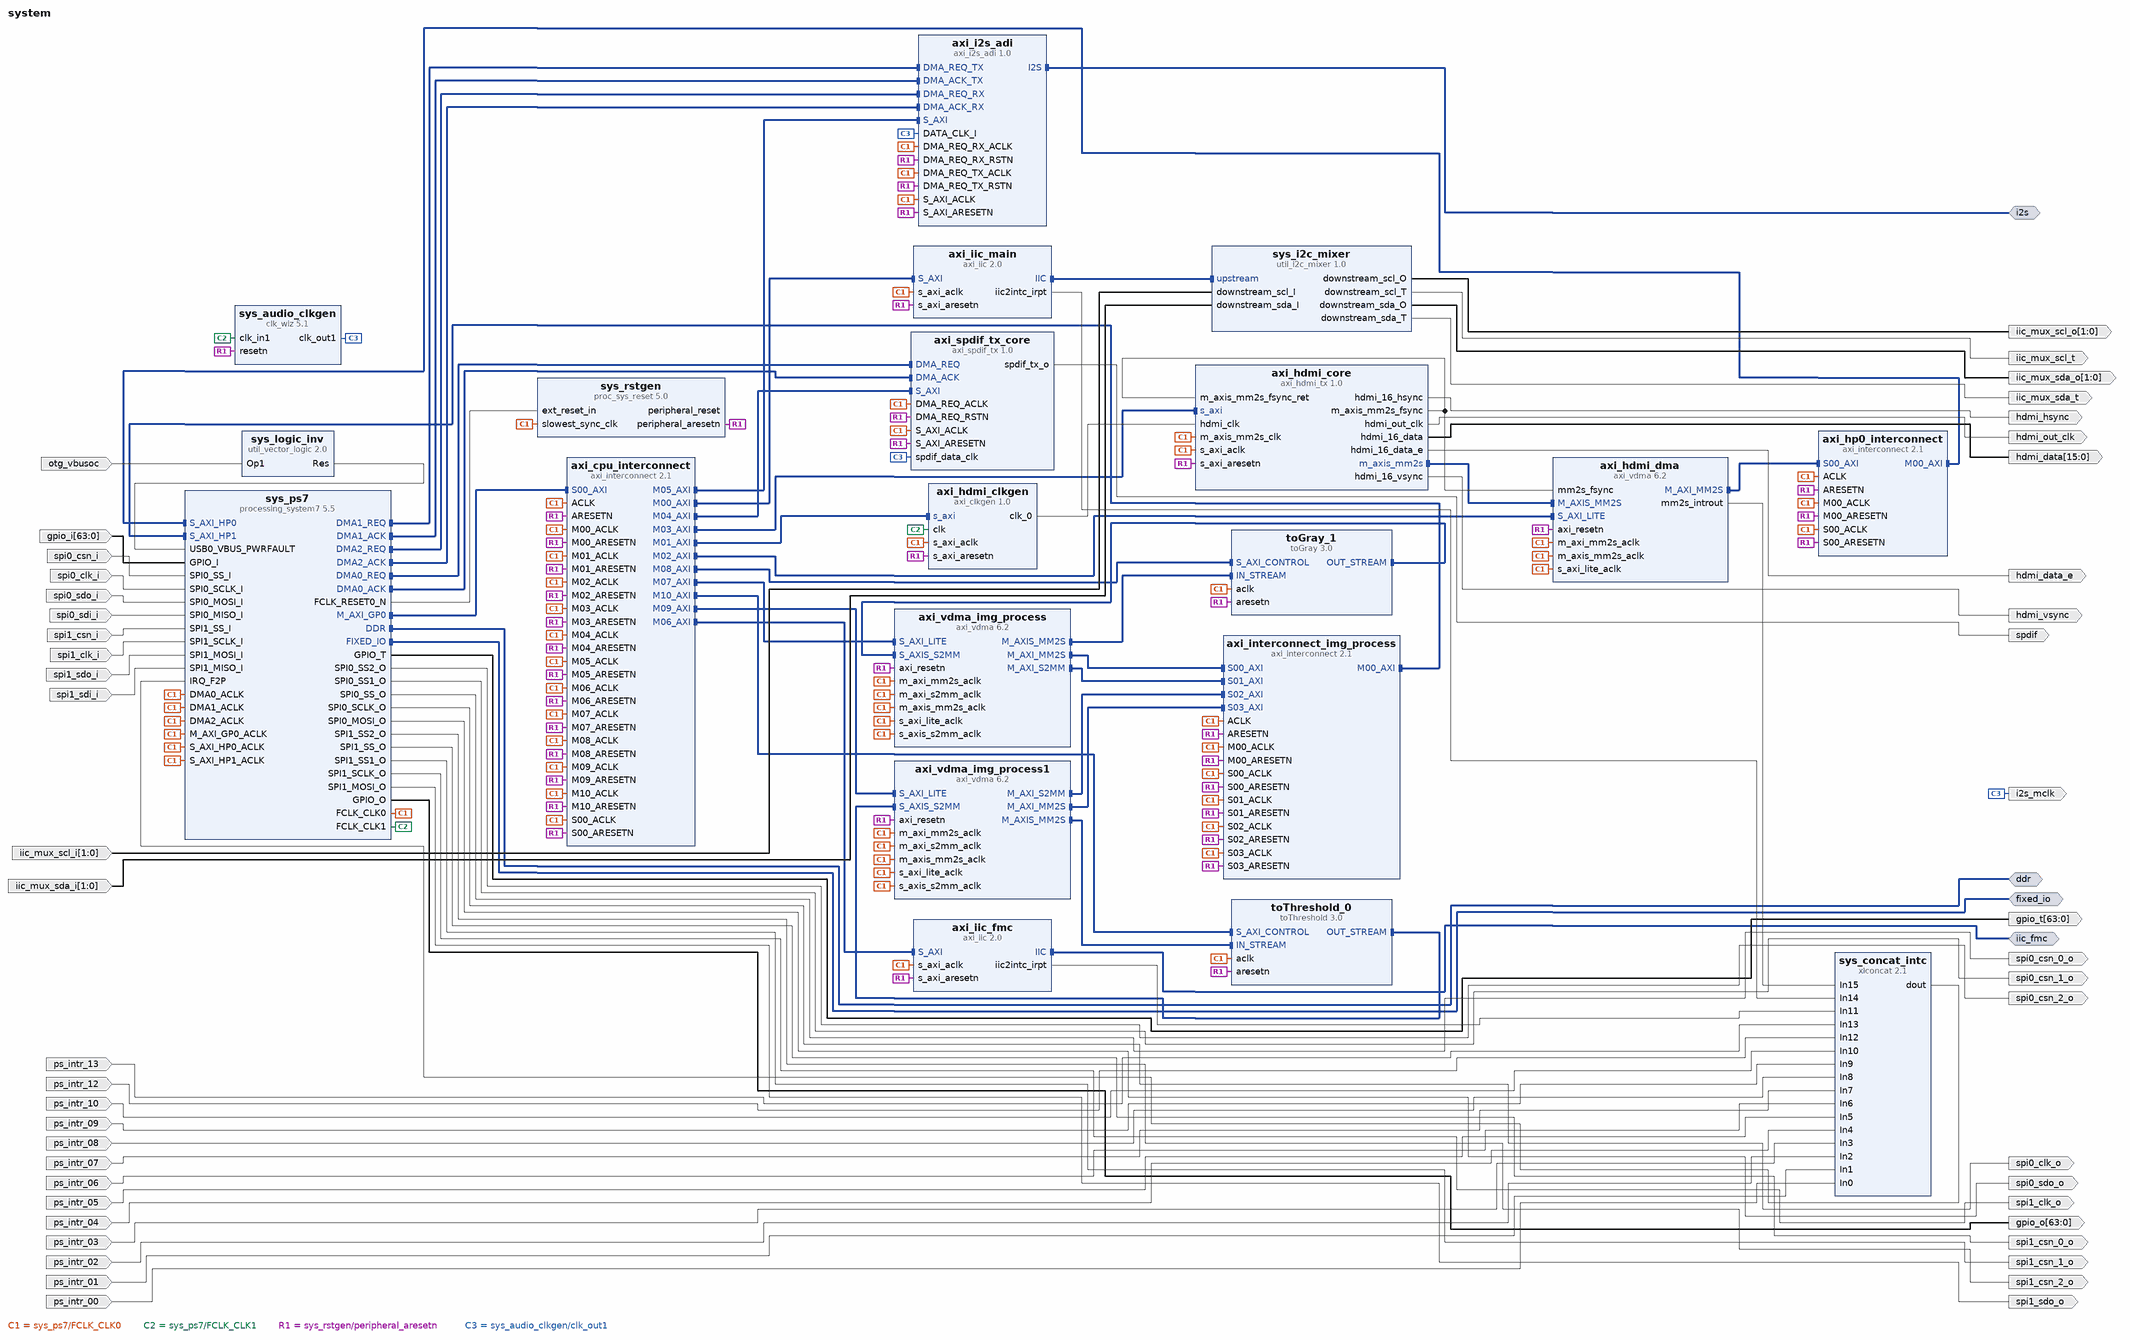
[diagram p0: block diagram of the top level]
# Vivado block design system, Vivado 2014.4
create_bd_design system

create_bd_intf_port -mode Master -vlnv xilinx.com:interface:ddrx_rtl:1.0 ddr
create_bd_intf_port -mode Master -vlnv xilinx.com:display_processing_system7:fixedio_rtl:1.0 fixed_io
create_bd_intf_port -mode Master -vlnv xilinx.com:interface:iic_rtl:1.0 iic_fmc
create_bd_intf_port -mode Master -vlnv analog.com:interface:i2s_rtl:1.0 i2s
create_bd_port -dir I -from 63 -to 0 gpio_i
create_bd_port -dir O -from 63 -to 0 gpio_t
create_bd_port -dir I -from 1 -to 0 iic_mux_scl_i
create_bd_port -dir O -from 1 -to 0 iic_mux_scl_o
create_bd_port -dir O iic_mux_scl_t
create_bd_port -dir I -from 1 -to 0 iic_mux_sda_i
create_bd_port -dir O -from 1 -to 0 iic_mux_sda_o
create_bd_port -dir O iic_mux_sda_t
create_bd_port -dir I otg_vbusoc
create_bd_port -dir O spi0_csn_2_o
create_bd_port -dir O spi0_csn_1_o
create_bd_port -dir O spi0_csn_0_o
create_bd_port -dir I spi0_csn_i
create_bd_port -dir I spi0_clk_i
create_bd_port -dir O spi0_clk_o
create_bd_port -dir I spi0_sdo_i
create_bd_port -dir O spi0_sdo_o
create_bd_port -dir I spi0_sdi_i
create_bd_port -dir O spi1_csn_2_o
create_bd_port -dir O spi1_csn_1_o
create_bd_port -dir O spi1_csn_0_o
create_bd_port -dir I spi1_csn_i
create_bd_port -dir I spi1_clk_i
create_bd_port -dir O spi1_clk_o
create_bd_port -dir I spi1_sdo_i
create_bd_port -dir O spi1_sdo_o
create_bd_port -dir I spi1_sdi_i
create_bd_port -dir O hdmi_out_clk
create_bd_port -dir O hdmi_hsync
create_bd_port -dir O hdmi_vsync
create_bd_port -dir O hdmi_data_e
create_bd_port -dir O -from 15 -to 0 hdmi_data
create_bd_port -dir O -type clk i2s_mclk
create_bd_port -dir O spdif
create_bd_port -dir I -type intr ps_intr_13
create_bd_port -dir I -type intr ps_intr_12
create_bd_port -dir I -type intr ps_intr_10
create_bd_port -dir I -type intr ps_intr_09
create_bd_port -dir I -type intr ps_intr_08
create_bd_port -dir I -type intr ps_intr_07
create_bd_port -dir I -type intr ps_intr_06
create_bd_port -dir I -type intr ps_intr_05
create_bd_port -dir I -type intr ps_intr_04
create_bd_port -dir I -type intr ps_intr_03
create_bd_port -dir I -type intr ps_intr_02
create_bd_port -dir I -type intr ps_intr_01
create_bd_port -dir I -type intr ps_intr_00
create_bd_port -dir O -from 63 -to 0 gpio_o

create_bd_cell -type ip -vlnv xilinx.com:ip:processing_system7:5.5 sys_ps7
set_property -dict [list \
  CONFIG.PCW_FPGA0_PERIPHERAL_FREQMHZ 100.0 \
  CONFIG.PCW_FPGA1_PERIPHERAL_FREQMHZ 200.0 \
  CONFIG.PCW_USE_S_AXI_HP0 1 \
  CONFIG.PCW_USE_S_AXI_HP1 1 \
  CONFIG.PCW_USE_DMA0 1 \
  CONFIG.PCW_USE_DMA1 1 \
  CONFIG.PCW_USE_DMA2 1 \
  CONFIG.PCW_USE_FABRIC_INTERRUPT 1 \
  CONFIG.PCW_EN_CLK1_PORT 1 \
  CONFIG.PCW_EN_RST1_PORT 1 \
  CONFIG.PCW_IRQ_F2P_INTR 1 \
  CONFIG.PCW_IRQ_F2P_MODE REVERSE \
  CONFIG.PCW_IMPORT_BOARD_PRESET ZedBoard \
  CONFIG.PCW_SPI0_PERIPHERAL_ENABLE 1 \
  CONFIG.PCW_SPI0_SPI0_IO EMIO \
  CONFIG.PCW_SPI1_PERIPHERAL_ENABLE 1 \
  CONFIG.PCW_SPI1_SPI1_IO EMIO \
  CONFIG.PCW_GPIO_EMIO_GPIO_ENABLE 1 \
  CONFIG.PCW_GPIO_EMIO_GPIO_IO 64 \
] [get_bd_cells sys_ps7]
# 1 more settings of sys_ps7 are not shown: defaults, MIO pin electricals, DDR timing, and values the tool derives
create_bd_cell -type ip -vlnv xilinx.com:ip:axi_iic:2.0 axi_iic_main
set_property -dict {CONFIG.USE_BOARD_FLOW true CONFIG.IIC_BOARD_INTERFACE Custom} [get_bd_cells axi_iic_main]
create_bd_cell -type ip -vlnv analog.com:user:util_i2c_mixer:1.0 sys_i2c_mixer
create_bd_cell -type ip -vlnv xilinx.com:ip:xlconcat:2.1 sys_concat_intc
set_property -dict {CONFIG.NUM_PORTS 16} [get_bd_cells sys_concat_intc]
create_bd_cell -type ip -vlnv xilinx.com:ip:proc_sys_reset:5.0 sys_rstgen
set_property -dict {CONFIG.C_EXT_RST_WIDTH 1} [get_bd_cells sys_rstgen]
create_bd_cell -type ip -vlnv xilinx.com:ip:util_vector_logic:2.0 sys_logic_inv
set_property -dict {CONFIG.C_SIZE 1 CONFIG.C_OPERATION not} [get_bd_cells sys_logic_inv]
create_bd_cell -type ip -vlnv analog.com:user:axi_clkgen:1.0 axi_hdmi_clkgen
create_bd_cell -type ip -vlnv analog.com:user:axi_hdmi_tx:1.0 axi_hdmi_core
create_bd_cell -type ip -vlnv xilinx.com:ip:axi_vdma:6.2 axi_hdmi_dma
set_property -dict [list \
  CONFIG.c_m_axis_mm2s_tdata_width 64 \
  CONFIG.c_use_mm2s_fsync 1 \
  CONFIG.c_include_s2mm 0 \
] [get_bd_cells axi_hdmi_dma]
create_bd_cell -type ip -vlnv xilinx.com:ip:clk_wiz:5.1 sys_audio_clkgen
set_property -dict [list \
  CONFIG.PRIM_IN_FREQ 200.000 \
  CONFIG.CLKOUT1_REQUESTED_OUT_FREQ 12.288 \
  CONFIG.USE_LOCKED false \
  CONFIG.USE_RESET true \
  CONFIG.RESET_TYPE ACTIVE_LOW \
] [get_bd_cells sys_audio_clkgen]
create_bd_cell -type ip -vlnv analog.com:user:axi_spdif_tx:1.0 axi_spdif_tx_core
set_property -dict {CONFIG.C_S_AXI_ADDR_WIDTH 16 CONFIG.C_DMA_TYPE 1} [get_bd_cells axi_spdif_tx_core]
create_bd_cell -type ip -vlnv analog.com:user:axi_i2s_adi:1.0 axi_i2s_adi
set_property -dict {CONFIG.C_S_AXI_ADDR_WIDTH 16 CONFIG.C_DMA_TYPE 1} [get_bd_cells axi_i2s_adi]
create_bd_cell -type ip -vlnv xilinx.com:ip:axi_iic:2.0 axi_iic_fmc
create_bd_cell -type ip -vlnv xilinx.com:ip:axi_interconnect:2.1 axi_cpu_interconnect
set_property -dict {CONFIG.NUM_MI 11} [get_bd_cells axi_cpu_interconnect]
create_bd_cell -type ip -vlnv xilinx.com:ip:axi_interconnect:2.1 axi_hp0_interconnect
set_property -dict {CONFIG.NUM_SI 1 CONFIG.NUM_MI 1} [get_bd_cells axi_hp0_interconnect]
create_bd_cell -type ip -vlnv xilinx.com:ip:axi_vdma:6.2 axi_vdma_img_process
set_property -dict [list \
  CONFIG.c_m_axi_mm2s_data_width 32 \
  CONFIG.c_m_axis_mm2s_tdata_width 24 \
  CONFIG.c_use_s2mm_fsync 0 \
  CONFIG.c_mm2s_max_burst_length 32 \
] [get_bd_cells axi_vdma_img_process]
create_bd_cell -type ip -vlnv xilinx.com:ip:axi_interconnect:2.1 axi_interconnect_img_process
set_property -dict {CONFIG.NUM_SI 4 CONFIG.NUM_MI 1} [get_bd_cells axi_interconnect_img_process]
create_bd_cell -type ip -vlnv xilinx.com:ip:axi_vdma:6.2 axi_vdma_img_process1
set_property -dict [list \
  CONFIG.c_m_axi_mm2s_data_width 32 \
  CONFIG.c_m_axis_mm2s_tdata_width 24 \
  CONFIG.c_use_s2mm_fsync 0 \
  CONFIG.c_mm2s_max_burst_length 32 \
] [get_bd_cells axi_vdma_img_process1]
create_bd_cell -type ip -vlnv esit:hls:toThreshold:3.0 toThreshold_0
create_bd_cell -type ip -vlnv esit:hls:toGray:3.0 toGray_1

# ---- connections ----

connect_bd_intf_net [get_bd_intf_pins axi_iic_main/IIC] [get_bd_intf_pins sys_i2c_mixer/upstream]
connect_bd_intf_net [get_bd_intf_pins axi_hdmi_core/m_axis_mm2s] [get_bd_intf_pins axi_hdmi_dma/M_AXIS_MM2S]
connect_bd_intf_net [get_bd_intf_pins sys_ps7/DMA0_REQ] [get_bd_intf_pins axi_spdif_tx_core/DMA_REQ]
connect_bd_intf_net [get_bd_intf_pins sys_ps7/DMA0_ACK] [get_bd_intf_pins axi_spdif_tx_core/DMA_ACK]
connect_bd_intf_net [get_bd_intf_pins sys_ps7/DMA1_REQ] [get_bd_intf_pins axi_i2s_adi/DMA_REQ_TX]
connect_bd_intf_net [get_bd_intf_pins sys_ps7/DMA1_ACK] [get_bd_intf_pins axi_i2s_adi/DMA_ACK_TX]
connect_bd_intf_net [get_bd_intf_pins sys_ps7/DMA2_REQ] [get_bd_intf_pins axi_i2s_adi/DMA_REQ_RX]
connect_bd_intf_net [get_bd_intf_pins sys_ps7/DMA2_ACK] [get_bd_intf_pins axi_i2s_adi/DMA_ACK_RX]
connect_bd_intf_net [get_bd_intf_pins axi_cpu_interconnect/S00_AXI] [get_bd_intf_pins sys_ps7/M_AXI_GP0]
connect_bd_intf_net [get_bd_intf_pins axi_cpu_interconnect/M00_AXI] [get_bd_intf_pins axi_iic_main/S_AXI]
connect_bd_intf_net [get_bd_intf_pins axi_cpu_interconnect/M01_AXI] [get_bd_intf_pins axi_hdmi_clkgen/s_axi]
connect_bd_intf_net [get_bd_intf_pins axi_cpu_interconnect/M02_AXI] [get_bd_intf_pins axi_hdmi_dma/S_AXI_LITE]
connect_bd_intf_net [get_bd_intf_pins axi_cpu_interconnect/M03_AXI] [get_bd_intf_pins axi_hdmi_core/s_axi]
connect_bd_intf_net [get_bd_intf_pins axi_cpu_interconnect/M04_AXI] [get_bd_intf_pins axi_spdif_tx_core/S_AXI]
connect_bd_intf_net [get_bd_intf_pins axi_cpu_interconnect/M05_AXI] [get_bd_intf_pins axi_i2s_adi/S_AXI]
connect_bd_intf_net [get_bd_intf_pins axi_cpu_interconnect/M06_AXI] [get_bd_intf_pins axi_iic_fmc/S_AXI]
connect_bd_intf_net [get_bd_intf_pins axi_hp0_interconnect/M00_AXI] [get_bd_intf_pins sys_ps7/S_AXI_HP0]
connect_bd_intf_net [get_bd_intf_pins axi_hp0_interconnect/S00_AXI] [get_bd_intf_pins axi_hdmi_dma/M_AXI_MM2S]
connect_bd_intf_net -intf_net axi_interconnect_0_M00_AXI [get_bd_intf_pins axi_interconnect_img_process/M00_AXI] [get_bd_intf_pins sys_ps7/S_AXI_HP1]
connect_bd_intf_net -intf_net img_process_vdma_M_AXI_MM2S [get_bd_intf_pins axi_vdma_img_process/M_AXI_MM2S] [get_bd_intf_pins axi_interconnect_img_process/S00_AXI]
connect_bd_intf_net -intf_net img_process_vdma_M_AXI_S2MM [get_bd_intf_pins axi_vdma_img_process/M_AXI_S2MM] [get_bd_intf_pins axi_interconnect_img_process/S01_AXI]
connect_bd_intf_net [get_bd_intf_pins axi_cpu_interconnect/M07_AXI] [get_bd_intf_pins axi_vdma_img_process/S_AXI_LITE]
connect_bd_intf_net [get_bd_intf_pins axi_vdma_img_process1/M_AXI_S2MM] [get_bd_intf_pins axi_interconnect_img_process/S02_AXI]
connect_bd_intf_net [get_bd_intf_pins axi_vdma_img_process1/M_AXI_MM2S] [get_bd_intf_pins axi_interconnect_img_process/S03_AXI]
connect_bd_intf_net [get_bd_intf_pins axi_cpu_interconnect/M09_AXI] [get_bd_intf_pins axi_vdma_img_process1/S_AXI_LITE]
connect_bd_intf_net [get_bd_intf_pins toThreshold_0/OUT_STREAM] [get_bd_intf_pins axi_vdma_img_process1/S_AXIS_S2MM]
connect_bd_intf_net [get_bd_intf_pins toThreshold_0/IN_STREAM] [get_bd_intf_pins axi_vdma_img_process1/M_AXIS_MM2S]
connect_bd_intf_net [get_bd_intf_pins axi_cpu_interconnect/M10_AXI] [get_bd_intf_pins toThreshold_0/S_AXI_CONTROL]
connect_bd_intf_net [get_bd_intf_pins toGray_1/IN_STREAM] [get_bd_intf_pins axi_vdma_img_process/M_AXIS_MM2S]
connect_bd_intf_net [get_bd_intf_pins toGray_1/OUT_STREAM] [get_bd_intf_pins axi_vdma_img_process/S_AXIS_S2MM]
connect_bd_intf_net [get_bd_intf_pins axi_cpu_interconnect/M08_AXI] [get_bd_intf_pins toGray_1/S_AXI_CONTROL]
connect_bd_intf_net [get_bd_intf_ports ddr] [get_bd_intf_pins sys_ps7/DDR]
connect_bd_intf_net [get_bd_intf_ports fixed_io] [get_bd_intf_pins sys_ps7/FIXED_IO]
connect_bd_intf_net [get_bd_intf_ports iic_fmc] [get_bd_intf_pins axi_iic_fmc/IIC]
connect_bd_intf_net [get_bd_intf_ports i2s] [get_bd_intf_pins axi_i2s_adi/I2S]
connect_bd_net -net sys_cpu_clk [get_bd_pins sys_ps7/FCLK_CLK0] \
  [get_bd_pins sys_rstgen/slowest_sync_clk] [get_bd_pins axi_hdmi_core/m_axis_mm2s_clk] \
  [get_bd_pins axi_hdmi_dma/s_axi_lite_aclk] [get_bd_pins axi_hdmi_dma/m_axi_mm2s_aclk] \
  [get_bd_pins axi_hdmi_dma/m_axis_mm2s_aclk] [get_bd_pins axi_spdif_tx_core/DMA_REQ_ACLK] [get_bd_pins sys_ps7/DMA0_ACLK] \
  [get_bd_pins axi_i2s_adi/DMA_REQ_RX_ACLK] [get_bd_pins axi_i2s_adi/DMA_REQ_TX_ACLK] [get_bd_pins sys_ps7/DMA1_ACLK] \
  [get_bd_pins sys_ps7/DMA2_ACLK] [get_bd_pins sys_ps7/M_AXI_GP0_ACLK] [get_bd_pins axi_iic_main/s_axi_aclk] \
  [get_bd_pins axi_hdmi_clkgen/s_axi_aclk] [get_bd_pins axi_hdmi_core/s_axi_aclk] [get_bd_pins axi_spdif_tx_core/S_AXI_ACLK] \
  [get_bd_pins axi_i2s_adi/S_AXI_ACLK] [get_bd_pins axi_iic_fmc/s_axi_aclk] [get_bd_pins sys_ps7/S_AXI_HP0_ACLK] \
  [get_bd_pins sys_ps7/S_AXI_HP1_ACLK] [get_bd_pins axi_vdma_img_process/s_axi_lite_aclk] \
  [get_bd_pins axi_vdma_img_process/s_axis_s2mm_aclk] [get_bd_pins axi_vdma_img_process/m_axi_s2mm_aclk] \
  [get_bd_pins axi_vdma_img_process/m_axis_mm2s_aclk] [get_bd_pins axi_vdma_img_process/m_axi_mm2s_aclk] \
  [get_bd_pins axi_cpu_interconnect/ACLK] [get_bd_pins axi_cpu_interconnect/S00_ACLK] \
  [get_bd_pins axi_cpu_interconnect/M00_ACLK] [get_bd_pins axi_cpu_interconnect/M01_ACLK] \
  [get_bd_pins axi_cpu_interconnect/M02_ACLK] [get_bd_pins axi_cpu_interconnect/M03_ACLK] \
  [get_bd_pins axi_cpu_interconnect/M04_ACLK] [get_bd_pins axi_cpu_interconnect/M05_ACLK] \
  [get_bd_pins axi_cpu_interconnect/M06_ACLK] [get_bd_pins axi_hp0_interconnect/ACLK] \
  [get_bd_pins axi_hp0_interconnect/M00_ACLK] [get_bd_pins axi_hp0_interconnect/S00_ACLK] \
  [get_bd_pins axi_cpu_interconnect/M07_ACLK] [get_bd_pins axi_interconnect_img_process/ACLK] \
  [get_bd_pins axi_interconnect_img_process/S00_ACLK] [get_bd_pins axi_interconnect_img_process/M00_ACLK] \
  [get_bd_pins axi_interconnect_img_process/S01_ACLK] [get_bd_pins axi_cpu_interconnect/M08_ACLK] \
  [get_bd_pins axi_vdma_img_process1/s_axi_lite_aclk] [get_bd_pins axi_cpu_interconnect/M09_ACLK] \
  [get_bd_pins axi_vdma_img_process1/s_axis_s2mm_aclk] [get_bd_pins axi_vdma_img_process1/m_axi_s2mm_aclk] \
  [get_bd_pins axi_vdma_img_process1/m_axis_mm2s_aclk] [get_bd_pins axi_vdma_img_process1/m_axi_mm2s_aclk] \
  [get_bd_pins toThreshold_0/aclk] [get_bd_pins axi_cpu_interconnect/M10_ACLK] [get_bd_pins toGray_1/aclk] \
  [get_bd_pins axi_interconnect_img_process/S02_ACLK] [get_bd_pins axi_interconnect_img_process/S03_ACLK]
connect_bd_net -net sys_200m_clk [get_bd_pins sys_ps7/FCLK_CLK1] [get_bd_pins axi_hdmi_clkgen/clk] [get_bd_pins sys_audio_clkgen/clk_in1]
# net sys_cpu_reset has one end: sys_rstgen/peripheral_reset
connect_bd_net -net sys_cpu_resetn [get_bd_pins sys_rstgen/peripheral_aresetn] \
  [get_bd_pins axi_spdif_tx_core/DMA_REQ_RSTN] [get_bd_pins sys_audio_clkgen/resetn] \
  [get_bd_pins axi_i2s_adi/DMA_REQ_TX_RSTN] [get_bd_pins axi_i2s_adi/DMA_REQ_RX_RSTN] \
  [get_bd_pins axi_iic_main/s_axi_aresetn] [get_bd_pins axi_hdmi_clkgen/s_axi_aresetn] [get_bd_pins axi_hdmi_dma/axi_resetn] \
  [get_bd_pins axi_hdmi_core/s_axi_aresetn] [get_bd_pins axi_spdif_tx_core/S_AXI_ARESETN] \
  [get_bd_pins axi_i2s_adi/S_AXI_ARESETN] [get_bd_pins axi_iic_fmc/s_axi_aresetn] \
  [get_bd_pins axi_vdma_img_process/axi_resetn] [get_bd_pins axi_cpu_interconnect/ARESETN] \
  [get_bd_pins axi_cpu_interconnect/S00_ARESETN] [get_bd_pins axi_cpu_interconnect/M00_ARESETN] \
  [get_bd_pins axi_cpu_interconnect/M01_ARESETN] [get_bd_pins axi_cpu_interconnect/M02_ARESETN] \
  [get_bd_pins axi_cpu_interconnect/M03_ARESETN] [get_bd_pins axi_cpu_interconnect/M04_ARESETN] \
  [get_bd_pins axi_cpu_interconnect/M05_ARESETN] [get_bd_pins axi_cpu_interconnect/M06_ARESETN] \
  [get_bd_pins axi_hp0_interconnect/ARESETN] [get_bd_pins axi_hp0_interconnect/M00_ARESETN] \
  [get_bd_pins axi_hp0_interconnect/S00_ARESETN] [get_bd_pins axi_cpu_interconnect/M07_ARESETN] \
  [get_bd_pins axi_interconnect_img_process/ARESETN] [get_bd_pins axi_interconnect_img_process/S00_ARESETN] \
  [get_bd_pins axi_interconnect_img_process/M00_ARESETN] [get_bd_pins axi_interconnect_img_process/S01_ARESETN] \
  [get_bd_pins axi_cpu_interconnect/M08_ARESETN] [get_bd_pins axi_vdma_img_process1/axi_resetn] \
  [get_bd_pins axi_cpu_interconnect/M09_ARESETN] [get_bd_pins toThreshold_0/aresetn] \
  [get_bd_pins axi_cpu_interconnect/M10_ARESETN] [get_bd_pins toGray_1/aresetn] \
  [get_bd_pins axi_interconnect_img_process/S03_ARESETN] [get_bd_pins axi_interconnect_img_process/S02_ARESETN]
connect_bd_net [get_bd_pins sys_ps7/FCLK_RESET0_N] [get_bd_pins sys_rstgen/ext_reset_in]
connect_bd_net [get_bd_ports gpio_i] [get_bd_pins sys_ps7/GPIO_I]
connect_bd_net [get_bd_pins sys_ps7/GPIO_T] [get_bd_ports gpio_t]
connect_bd_net [get_bd_ports iic_mux_scl_i] [get_bd_pins sys_i2c_mixer/downstream_scl_I]
connect_bd_net [get_bd_pins sys_i2c_mixer/downstream_scl_O] [get_bd_ports iic_mux_scl_o]
connect_bd_net [get_bd_pins sys_i2c_mixer/downstream_scl_T] [get_bd_ports iic_mux_scl_t]
connect_bd_net [get_bd_ports iic_mux_sda_i] [get_bd_pins sys_i2c_mixer/downstream_sda_I]
connect_bd_net [get_bd_pins sys_i2c_mixer/downstream_sda_O] [get_bd_ports iic_mux_sda_o]
connect_bd_net [get_bd_pins sys_i2c_mixer/downstream_sda_T] [get_bd_ports iic_mux_sda_t]
connect_bd_net [get_bd_pins sys_logic_inv/Res] [get_bd_pins sys_ps7/USB0_VBUS_PWRFAULT]
connect_bd_net [get_bd_ports otg_vbusoc] [get_bd_pins sys_logic_inv/Op1]
connect_bd_net [get_bd_pins sys_ps7/SPI0_SS2_O] [get_bd_ports spi0_csn_2_o]
connect_bd_net [get_bd_pins sys_ps7/SPI0_SS1_O] [get_bd_ports spi0_csn_1_o]
connect_bd_net [get_bd_pins sys_ps7/SPI0_SS_O] [get_bd_ports spi0_csn_0_o]
connect_bd_net [get_bd_ports spi0_csn_i] [get_bd_pins sys_ps7/SPI0_SS_I]
connect_bd_net [get_bd_ports spi0_clk_i] [get_bd_pins sys_ps7/SPI0_SCLK_I]
connect_bd_net [get_bd_pins sys_ps7/SPI0_SCLK_O] [get_bd_ports spi0_clk_o]
connect_bd_net [get_bd_ports spi0_sdo_i] [get_bd_pins sys_ps7/SPI0_MOSI_I]
connect_bd_net [get_bd_pins sys_ps7/SPI0_MOSI_O] [get_bd_ports spi0_sdo_o]
connect_bd_net [get_bd_ports spi0_sdi_i] [get_bd_pins sys_ps7/SPI0_MISO_I]
connect_bd_net [get_bd_pins sys_ps7/SPI1_SS2_O] [get_bd_ports spi1_csn_2_o]
connect_bd_net [get_bd_pins sys_ps7/SPI1_SS1_O] [get_bd_ports spi1_csn_1_o]
connect_bd_net [get_bd_pins sys_ps7/SPI1_SS_O] [get_bd_ports spi1_csn_0_o]
connect_bd_net [get_bd_ports spi1_csn_i] [get_bd_pins sys_ps7/SPI1_SS_I]
connect_bd_net [get_bd_ports spi1_clk_i] [get_bd_pins sys_ps7/SPI1_SCLK_I]
connect_bd_net [get_bd_pins sys_ps7/SPI1_SCLK_O] [get_bd_ports spi1_clk_o]
connect_bd_net [get_bd_ports spi1_sdo_i] [get_bd_pins sys_ps7/SPI1_MOSI_I]
connect_bd_net [get_bd_pins sys_ps7/SPI1_MOSI_O] [get_bd_ports spi1_sdo_o]
connect_bd_net [get_bd_ports spi1_sdi_i] [get_bd_pins sys_ps7/SPI1_MISO_I]
connect_bd_net [get_bd_pins axi_hdmi_clkgen/clk_0] [get_bd_pins axi_hdmi_core/hdmi_clk]
connect_bd_net [get_bd_pins axi_hdmi_core/hdmi_out_clk] [get_bd_ports hdmi_out_clk]
connect_bd_net [get_bd_pins axi_hdmi_core/hdmi_16_hsync] [get_bd_ports hdmi_hsync]
connect_bd_net [get_bd_pins axi_hdmi_core/hdmi_16_vsync] [get_bd_ports hdmi_vsync]
connect_bd_net [get_bd_pins axi_hdmi_core/hdmi_16_data_e] [get_bd_ports hdmi_data_e]
connect_bd_net [get_bd_pins axi_hdmi_core/hdmi_16_data] [get_bd_ports hdmi_data]
connect_bd_net [get_bd_pins axi_hdmi_core/m_axis_mm2s_fsync] [get_bd_pins axi_hdmi_dma/mm2s_fsync] [get_bd_pins axi_hdmi_core/m_axis_mm2s_fsync_ret]
connect_bd_net [get_bd_pins sys_audio_clkgen/clk_out1] \
  [get_bd_ports i2s_mclk] [get_bd_pins axi_spdif_tx_core/spdif_data_clk] [get_bd_pins axi_i2s_adi/DATA_CLK_I]
connect_bd_net [get_bd_pins axi_spdif_tx_core/spdif_tx_o] [get_bd_ports spdif]
connect_bd_net [get_bd_pins sys_concat_intc/dout] [get_bd_pins sys_ps7/IRQ_F2P]
connect_bd_net [get_bd_pins axi_hdmi_dma/mm2s_introut] [get_bd_pins sys_concat_intc/In15]
connect_bd_net [get_bd_pins axi_iic_main/iic2intc_irpt] [get_bd_pins sys_concat_intc/In14]
connect_bd_net -net ps_intr_13_1 [get_bd_ports ps_intr_13] [get_bd_pins sys_concat_intc/In13]
connect_bd_net -net ps_intr_12_1 [get_bd_ports ps_intr_12] [get_bd_pins sys_concat_intc/In12]
connect_bd_net [get_bd_pins axi_iic_fmc/iic2intc_irpt] [get_bd_pins sys_concat_intc/In11]
connect_bd_net -net ps_intr_10_1 [get_bd_ports ps_intr_10] [get_bd_pins sys_concat_intc/In10]
connect_bd_net -net ps_intr_09_1 [get_bd_ports ps_intr_09] [get_bd_pins sys_concat_intc/In9]
connect_bd_net -net ps_intr_08_1 [get_bd_ports ps_intr_08] [get_bd_pins sys_concat_intc/In8]
connect_bd_net -net ps_intr_07_1 [get_bd_ports ps_intr_07] [get_bd_pins sys_concat_intc/In7]
connect_bd_net -net ps_intr_06_1 [get_bd_ports ps_intr_06] [get_bd_pins sys_concat_intc/In6]
connect_bd_net -net ps_intr_05_1 [get_bd_ports ps_intr_05] [get_bd_pins sys_concat_intc/In5]
connect_bd_net -net ps_intr_04_1 [get_bd_ports ps_intr_04] [get_bd_pins sys_concat_intc/In4]
connect_bd_net -net ps_intr_03_1 [get_bd_ports ps_intr_03] [get_bd_pins sys_concat_intc/In3]
connect_bd_net -net ps_intr_02_1 [get_bd_ports ps_intr_02] [get_bd_pins sys_concat_intc/In2]
connect_bd_net -net ps_intr_01_1 [get_bd_ports ps_intr_01] [get_bd_pins sys_concat_intc/In1]
connect_bd_net -net ps_intr_00_1 [get_bd_ports ps_intr_00] [get_bd_pins sys_concat_intc/In0]
connect_bd_net [get_bd_pins sys_ps7/GPIO_O] [get_bd_ports gpio_o]

# ---- address map ----
assign_bd_address -offset 0x0 -range 512M -target_address_space [get_bd_addr_spaces axi_hdmi_dma/Data_MM2S] [get_bd_addr_segs sys_ps7/S_AXI_HP0/HP0_DDR_LOWOCM]
assign_bd_address -offset 0x0 -range 512M -target_address_space [get_bd_addr_spaces axi_vdma_img_process1/Data_MM2S] [get_bd_addr_segs sys_ps7/S_AXI_HP1/HP1_DDR_LOWOCM]
assign_bd_address -offset 0x0 -range 512M -target_address_space [get_bd_addr_spaces axi_vdma_img_process1/Data_S2MM] [get_bd_addr_segs sys_ps7/S_AXI_HP1/HP1_DDR_LOWOCM]
assign_bd_address -offset 0x0 -range 512M -target_address_space [get_bd_addr_spaces axi_vdma_img_process/Data_MM2S] [get_bd_addr_segs sys_ps7/S_AXI_HP1/HP1_DDR_LOWOCM]
assign_bd_address -offset 0x0 -range 512M -target_address_space [get_bd_addr_spaces axi_vdma_img_process/Data_S2MM] [get_bd_addr_segs sys_ps7/S_AXI_HP1/HP1_DDR_LOWOCM]
assign_bd_address -offset 0x41600000 -range 64K -target_address_space [get_bd_addr_spaces sys_ps7/Data] [get_bd_addr_segs axi_iic_main/S_AXI/Reg]
assign_bd_address -offset 0x41620000 -range 64K -target_address_space [get_bd_addr_spaces sys_ps7/Data] [get_bd_addr_segs axi_iic_fmc/S_AXI/Reg]
assign_bd_address -offset 0x43000000 -range 64K -target_address_space [get_bd_addr_spaces sys_ps7/Data] [get_bd_addr_segs axi_hdmi_dma/S_AXI_LITE/Reg]
assign_bd_address -offset 0x43010000 -range 64K -target_address_space [get_bd_addr_spaces sys_ps7/Data] [get_bd_addr_segs axi_vdma_img_process/S_AXI_LITE/Reg]
assign_bd_address -offset 0x43030000 -range 64K -target_address_space [get_bd_addr_spaces sys_ps7/Data] [get_bd_addr_segs axi_vdma_img_process1/S_AXI_LITE/Reg]
assign_bd_address -offset 0x43C00000 -range 64K -target_address_space [get_bd_addr_spaces sys_ps7/Data] [get_bd_addr_segs toThreshold_0/S_AXI_CONTROL/Reg]
assign_bd_address -offset 0x43C10000 -range 64K -target_address_space [get_bd_addr_spaces sys_ps7/Data] [get_bd_addr_segs toGray_1/S_AXI_CONTROL/Reg]
assign_bd_address -offset 0x70E00000 -range 64K -target_address_space [get_bd_addr_spaces sys_ps7/Data] [get_bd_addr_segs axi_hdmi_core/s_axi/axi_lite]
assign_bd_address -offset 0x75C00000 -range 64K -target_address_space [get_bd_addr_spaces sys_ps7/Data] [get_bd_addr_segs axi_spdif_tx_core/S_AXI/reg0]
assign_bd_address -offset 0x77600000 -range 64K -target_address_space [get_bd_addr_spaces sys_ps7/Data] [get_bd_addr_segs axi_i2s_adi/S_AXI/reg0]
assign_bd_address -offset 0x79000000 -range 64K -target_address_space [get_bd_addr_spaces sys_ps7/Data] [get_bd_addr_segs axi_hdmi_clkgen/s_axi/axi_lite]

validate_bd_design
save_bd_design
